# Altium schematic sheet rtm-damp-dvb-ADC-circuit.SchDoc
size A4
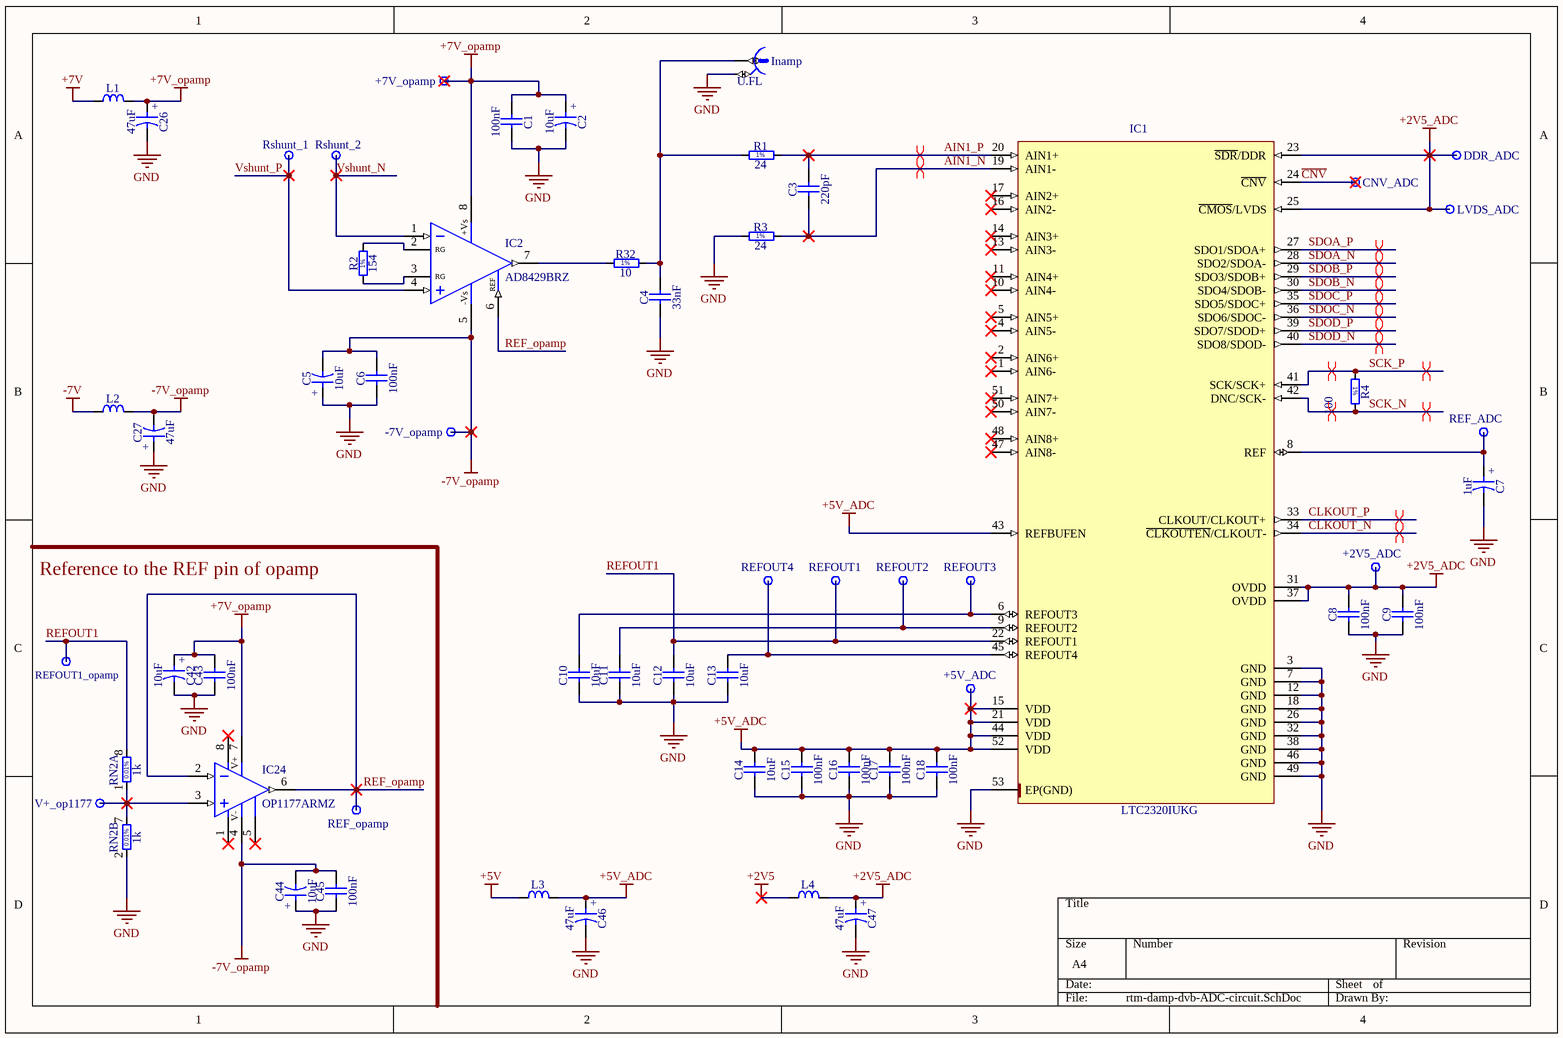
[diagram p0: rtm-damp-dvb-ADC-circuit.SchDoc]

## Parts
+2V5_ADC  Test Point  [TPS127]  (value not drawn)
+5V_ADC  Test Point  [TPS127]  (value not drawn)
+7V_opamp  Test Point  [TPS127]  (value not drawn)
-7V_opamp  Test Point  [TPS127]  (value not drawn)
C1  100nF  [CAPC2012X135N]
C2  10uF  [CAPAE530X540N]
C3  220pF  [CAPC1608X87N]
C4  33nF  [CAPC1608X87N]
C5  10uF  [CAPAE530X540N]
C6  100nF  [CAPC2012X135N]
C7  1uF  [CAPMP3216X180N]
C8  100nF  [CAPC2012X135N]
C9  100nF  [CAPC2012X135N]
C10  10uF  [CAPC2012X95N]
C11  10uF  [CAPC2012X95N]
C12  10uF  [CAPC2012X95N]
C13  10uF  [CAPC2012X95N]
C14  10uF  [CAPC2012X95N]
C15  100nF  [CAPC2012X135N]
C16  100nF  [CAPC2012X135N]
C17  100nF  [CAPC2012X135N]
C18  100nF  [CAPC2012X135N]
C26  47uF  [CAPMP3528X210N]
C27  47uF  [CAPMP3528X210N]
C42  10uF  [CAPAE530X540N]
C43  100nF  [CAPC2012X135N]
C44  10uF  [CAPAE530X540N]
C45  100nF  [CAPC2012X135N]
C46  47uF  [CAPMP3528X210N]
C47  47uF  [CAPMP3528X210N]
CNV_ADC  Test Point  [TPS127]  (value not drawn)
DDR_ADC  Test Point  [TPS127]  (value not drawn)
IC1  LTC2320IUKG  [QFN50P700X800X80-53N-R655X550]
IC2  AD8429BRZ  [SOIC127P600X175-8N]
IC24  OP1177ARMZ  [SOP65P490X110-8N]
Inamp  U.FL  [HIROSE_U.FL-R-SMT-1(10)]
L1  1K@100MHz  [INDC1608X95N]  (value not drawn)
L2  1K@100MHz  [INDC1608X95N]  (value not drawn)
L3  1K@100MHz  [INDC1608X95N]  (value not drawn)
L4  1K@100MHz  [INDC1608X95N]  (value not drawn)
LVDS_ADC  Test Point  [TPS127]  (value not drawn)
R1  24  [RESC1608X55N]
R2  154  [RESC1608X55N]
R3  24  [RESC1608X55N]
R4  100  [RESC1608X55N]
R32  10  [RESC1608X55N]
REF_ADC  Test Point  [TPS127]  (value not drawn)
REF_opamp  Test Point  [TPS127]  (value not drawn)
REFOUT1  Test Point  [TPS127]  (value not drawn)
REFOUT1_opamp  Test Point  [TPS127]  (value not drawn)
REFOUT2  Test Point  [TPS127]  (value not drawn)
REFOUT3  Test Point  [TPS127]  (value not drawn)
REFOUT4  Test Point  [TPS127]  (value not drawn)
RN2  1k  [SOIC127P600X175-8N]  (parts A,B of 4)
Rshunt_1  Test Point  [TPS127]  (value not drawn)
Rshunt_2  Test Point  [TPS127]  (value not drawn)
V+_op1177  Test Point  [TPS127]  (value not drawn)

## Nets
+2V5: L4.1
+2V5_ADC: +2V5_ADC.1 C8.2 C9.2 C47.1 DDR_ADC.1 IC1.23(~{SDR}/DDR) IC1.25(~{CMOS}/LVDS) IC1.31(OVDD) IC1.37(OVDD) L4.2 LVDS_ADC.1
+5V: L3.1
+5V_ADC: +5V_ADC.1 C14.2 C15.2 C16.2 C17.2 C18.2 C46.1 IC1.15(VDD) IC1.21(VDD) IC1.43(REFBUFEN) IC1.44(VDD) IC1.52(VDD) L3.2
+7V: L1.1
+7V_opamp: +7V_opamp.1 C1.1 C2.1 C26.1 C42.1 C43.2 IC2.8(+Vs) IC24.7(V+) L1.2
-7V: L2.1
-7V_opamp: -7V_opamp.1 C5.2 C6.2 C27.2 C44.2 C45.2 IC2.5(-Vs) IC24.4(V-) L2.2
GND: C1.2 C2.2 C4.1 C5.1 C6.1 C7.2 C8.1 C9.1 C10.1 C11.1 C12.1 C13.1 C14.1 C15.1 C16.1 C17.1 C18.1 C26.2 C27.1 C42.2 C43.1 C44.1 C45.1 C46.2 C47.2 IC1.3(GND) IC1.7(GND) IC1.12(GND) IC1.18(GND) IC1.26(GND) IC1.32(GND) IC1.38(GND) IC1.46(GND) IC1.49(GND) IC1.53(EP(GND)) Inamp.2 R3.1 RN2.2
AIN1_N: C3.1 IC1.19(AIN1-) R3.2
AIN1_P: C3.2 IC1.20(AIN1+) R1.2
~{CNV}: CNV_ADC.1 IC1.24(~{CNV})
CLKOUT_N: IC1.34(~{CLKOUTEN}/CLKOUT-)
CLKOUT_P: IC1.33(CLKOUT/CLKOUT+)
REF_opamp: IC2.6(REF) IC24.2(IN-) IC24.6(OUT) REF_opamp.1
REFOUT1: C12.2 IC1.22(REFOUT1) REFOUT1.1 REFOUT1_opamp.1 RN2.8
SCK_N: IC1.42(DNC/SCK-) R4.2
SCK_P: IC1.41(SCK/SCK+) R4.1
SDOA_N: IC1.28(SDO2/SDOA-)
SDOA_P: IC1.27(SDO1/SDOA+)
SDOB_N: IC1.30(SDO4/SDOB-)
SDOB_P: IC1.29(SDO3/SDOB+)
SDOC_N: IC1.36(SDO6/SDOC-)
SDOC_P: IC1.35(SDO5/SDOC+)
SDOD_N: IC1.40(SDO8/SDOD-)
SDOD_P: IC1.39(SDO7/SDOD+)
Vshunt_N: IC2.1(-IN) Rshunt_2.1
Vshunt_P: IC2.4(+IN) Rshunt_1.1
NetC4_2: C4.2 Inamp.1 R1.1 R32.2
NetC7_1: C7.1 IC1.8(REF) REF_ADC.1
NetC10_2: C10.2 IC1.6(REFOUT3) REFOUT3.1
NetC11_2: C11.2 IC1.9(REFOUT2) REFOUT2.1
NetC13_2: C13.2 IC1.45(REFOUT4) REFOUT4.1
NetIC2_2: IC2.2(RG) R2.2
NetIC2_3: IC2.3(RG) R2.1
NetIC2_7: IC2.7(Vout) R32.1
NetIC24_3: IC24.3(IN+) RN2.1 RN2.7 V+_op1177.1

Not connected (* = marked no-connect by the designer): IC1 1(AIN6-)* 2(AIN6+)* 4(AIN5-)* 5(AIN5+)* 10(AIN4-)* 11(AIN4+)* 13(AIN3-)* 14(AIN3+)* 16(AIN2-)* 17(AIN2+)* 47(AIN8-)* 48(AIN8+)* 50(AIN7-)* 51(AIN7+)*; IC24 1(NC)* 5(NC)* 8(NC)*

## Layout directives
differential pair: AIN1_N, AIN1_P, CLKOUT_N, CLKOUT_P, SCK_N, SCK_P, SDOA_N, SDOA_P, SDOB_N, SDOB_P, SDOC_N, SDOC_P, SDOD_N, SDOD_P

## Notes on the sheet
- Reference to the REF pin of opamp
- (in symbol CAE530-540_10UF_35V_20%) +
- (in symbol CTE3216-18_1UF_35V_10%_LESR3000) +
- (in symbol CTE3528-21_47UF_6.3V_10%_LESR0250) +
- (in symbol R0603_10R_1%_0.1W_200PPM) 1%
- (in symbol R0603_24R_1%_0.1W_100PPM) 1%
- (in symbol R0603_100R_1%_0.1W_100PPM) 1%
- (in symbol R0603_154R_1%_0.063W_10PPM) 1%

## Library data of the parts
+2V5_ADC +5V_ADC +7V_opamp -7V_opamp CNV_ADC DDR_ADC LVDS_ADC REF_ADC REF_opamp REFOUT1 REFOUT1_opamp REFOUT2-REFOUT4 Rshunt_1 Rshunt_2 V+_op1177 = SMD_PAD_1.27X1.27MM: Part Description: 1.27mm x 1.27mm PCB Copper Area (SMD Test Point); Mounted: No; Part Number: SMD_PAD_1.27X1.27MM; Component Kind: Standard (No BOM); Component Type: Standard (No BOM); Pin Count: 1; Family: Test Point; Socket: No; SMD: Yes; Sense: No; Status: None; ComponentHeight: 0mm; HelpURL: Undefined; Author: CERN DEM JLC; CreateDate: 12/01/2008; LatestRevisionDate: 12/01/2008; PackageDescription: 1.27mm x 1.27mm PCB Copper Area (SMD Test Point)
C1 C6 C8 C9 C15-C18 C43 C45 = CC0805_100NF_50V_10%_X7R: Non-polarised capacitor; Part Description: SMD Multilayer Chip Ceramic Capacitor; Manufacturer: GENERIC; Manufacturer1 Part Number: C2012X7R1H104K085AA; Voltage: 50V; TC: X7R; Tolerance: ±10%; Part Number: CC0805_100NF_50V_10%_X7R; Component Kind: Standard; Component Type: Standard; Pin Count: 2; Value: 100nF; Status: Preferred; Manufacturer Part Number: CC0805_100NF_50V_10%_X7R; Case: 0805; Mounted: Yes; Socket: No; SMD: Yes; Sense: No; Manufacturer1 Example: TDK; Manufacturer1 ComponentHeight: 1mm; HelpURL: \\cern.ch\dfs\Applications\Altium\Datasheets\CC0805_X7R_TDK_C.pdf; Author: CERN DEM JLC; CreateDate: 03/12/2007; LatestRevisionDate: 22/04/2015
C2 C5 C42 C44 = CAE530-540_10UF_35V_20%: Polarised capacitor; Part Description: Aluminum Electrolytic SMT Capacitor; Manufacturer: PANASONIC; Manufacturer Part Number: EEEFK1V100AR; Voltage: 35V; Tolerance: ±20%; Part Number: CAE530-540_10UF_35V_20%; Component Kind: Standard; Component Type: Standard; Pin Count: 2; Value: 10uF; Status: Not Recommended; Case: C; Mounted: Yes; Socket: No; SMD: Yes; Sense: No; ComponentHeight: 5.8mm; HelpURL: \\cern.ch\dfs\Applications\Altium\Datasheets\CAE_PANASONIC_FK.pdf; Author: CERN DEM JLC; CreateDate: 03/12/2007; LatestRevisionDate: 05/11/2014
C3 = CC0603_220PF_50V_5%_NP0: Non-polarised capacitor; Part Description: SMD Multilayer Chip Ceramic Capacitor; Manufacturer: GENERIC; Manufacturer1 Part Number: 223886715221; Voltage: 50V; TC: C0G/NP0; Tolerance: ±5%; Part Number: CC0603_220PF_50V_5%_NP0; Component Kind: Standard; Component Type: Standard; Pin Count: 2; Value: 220pF; Status: Preferred; Manufacturer Part Number: CC0603_220PF_50V_5%_NP0; Case: 0603; Mounted: Yes; Socket: No; SMD: Yes; Sense: No; Manufacturer1 Example: PHYCOMP; Manufacturer1 ComponentHeight: 0.87mm; HelpURL: \\cern.ch\dfs\Applications\Altium\Datasheets\CC0603_NP0_PHYCOMP.pdf; Author: CERN DEM JLC; CreateDate: 03/12/2007; LatestRevisionDate: 03/12/2007
C4 = CC0603_33NF_25V_10%_X7R: Non-polarised capacitor; Part Description: SMD Multilayer Chip Ceramic Capacitor; Manufacturer: GENERIC; Manufacturer1 Part Number: 223891615643; Voltage: 25V; TC: X7R; Tolerance: ±10%; Part Number: CC0603_33NF_25V_10%_X7R; Component Kind: Standard; Component Type: Standard; Pin Count: 2; Value: 33nF; Status: Preferred; Manufacturer Part Number: CC0603_33NF_25V_10%_X7R; Case: 0603; Mounted: Yes; Socket: No; SMD: Yes; Sense: No; Manufacturer1 Example: PHYCOMP; Manufacturer1 ComponentHeight: 0.87mm; HelpURL: \\cern.ch\dfs\Applications\Altium\Datasheets\CC0603_X7R_PHYCOMP.pdf; Author: CERN DEM JLC; CreateDate: 03/12/2007; LatestRevisionDate: 03/12/2007
C7 = CTE3216-18_1UF_35V_10%_LESR3000: Polarised capacitor; Part Description: Low ESR 3R0 Solid Tantalum Chip Capacitor; Manufacturer: GENERIC; Manufacturer1 Part Number: TPSA105K035R3000; Voltage: 35V; Tolerance: ±10%; Part Number: CTE3216-18_1UF_35V_10%_LESR3000; Component Kind: Standard; Component Type: Standard; Pin Count: 2; Value: 1uF; Status: Preferred; Manufacturer Part Number: CTE3216-18_1UF_35V_10%_LESR3000; Case: A; Mounted: Yes; Socket: No; SMD: Yes; Sense: No; Manufacturer1 Example: AVX; Manufacturer1 ComponentHeight: 1.8mm; HelpURL: \\cern.ch\dfs\Applications\Altium\Datasheets\CTE-LESR_AVX_TPS.pdf; Author: CERN DEM JLC; CreateDate: 05/05/2008; LatestRevisionDate: 20/01/2009
C10-C14 = CC0805_10UF_25V_10%_X5R: Non-polarised capacitor; Part Description: SMD Multilayer Chip Ceramic Capacitor; Manufacturer: GENERIC; Manufacturer1 Part Number: GRM219R61E106KA12D; Voltage: 25V; TC: X5R; Tolerance: ±10%; Part Number: CC0805_10UF_25V_10%_X5R; Component Kind: Standard; Component Type: Standard; Pin Count: 2; Value: 10uF; Status: Preferred; Manufacturer Part Number: CC0805_10UF_25V_10%_X5R; Case: 0805; Mounted: Yes; Socket: No; SMD: Yes; Sense: No; Manufacturer1 Example: MURATA; Manufacturer1 ComponentHeight: 0.95mm; HelpURL: \\cern.ch\dfs\Applications\Altium\Datasheets\CC0805_X5R_MURATA_GRM.pdf; Author: CERN DEM JLC; CreateDate: 25/10/2012; LatestRevisionDate: 06/09/2016
C26 C27 C46 C47 = CTE3528-21_47UF_6.3V_10%_LESR0250: Polarised capacitor; Part Description: Low ESR 0R25 Solid Tantalum Chip Capacitor; Manufacturer: GENERIC; Manufacturer1 Part Number: TPSB476K006R0250; Voltage: 6.3V; Tolerance: ±10%; Part Number: CTE3528-21_47UF_6.3V_10%_LESR0250; Component Kind: Standard; Component Type: Standard; Pin Count: 2; Value: 47uF; Status: Preferred; Manufacturer Part Number: CTE3528-21_47UF_6.3V_10%_LESR0250; Case: B; Mounted: Yes; Socket: No; SMD: Yes; Sense: No; Manufacturer1 Example: AVX; Manufacturer1 ComponentHeight: 2.1mm; HelpURL: \\cern.ch\dfs\Applications\Altium\Datasheets\CTE-LESR_AVX_TPS.pdf; Author: CERN DEM JLC; CreateDate: 05/05/2008; LatestRevisionDate: 20/01/2009
IC1 = LTC2320IUKG: Octal, 16-Bit, 1.5Msps/Ch  Simultaneous Sampling ADC; Manufacturer: LINEAR TECHNOLOGY; PressFit: No; Bonding: No; Part Number: LTC2320IUKG; Component Kind: Standard; Component Type: Standard; Device: LTC2320IUKG; PackageDescription: QFP, 0.50mm pitch, square; 12 pin X 14 pin, 7.00mm X 8.00mm, IPC Medium Density; Part Description: Octal, 16-Bit, 1.5Msps/Ch Simultaneous Sampling ADC; Manufacturer Part Number: LTC2320IUKG; Pin Count: 53; Case: QFN52; Mounted: Yes; Socket: No; SMD: Yes; Sense: No; ComponentHeight: 0.8mm; Author: LNLS DIG LOS; CreateDate: 21/02/2018; LatestRevisionDate: 08/03/2018
IC2 = AD8429BRZ: 1 nV/sqrt Hz Low Noise Instrumentation Amplifier; Manufacturer: ANALOG DEVICES; PressFit: No; Bonding: No; Part Number: AD8429BRZ; Component Kind: Standard; Component Type: Standard; Device: AD8429BRZ; PackageDescription: SOIC 8, Pitch 1.27mm - Body 4x5mm, IPC Medium Density; Part Description: 1nV/sqrt Hz Low Noise Instrumentation Amplifier; Manufacturer Part Number: AD8429BRZ; Pin Count: 8; Case: SOIC8; Mounted: Yes; Socket: No; SMD: Yes; Sense: No; ComponentHeight: 1.75mm; Author: CERN DEM JLC; HelpURL: \\cern.ch\dfs\Applications\Altium\Datasheets\AD8429BRZ.pdf; CreateDate: 31/08/2011; LatestRevisionDate: 31/08/2011
IC24 = OP1177ARMZ: Operational Amplifier; Part Description: Precision Low Noise, Low Input Bias Current Operational Amplifiers; Manufacturer: ANALOG DEVICES; PressFit: No; Bonding: No; Part Number: OP1177ARMZ; Component Kind: Standard; Component Type: Standard; Device: OP1177ARMZ; PackageDescription: SOP, 0.65mm pitch; 8 pin, 3.00mm W X 3.00mm L X 1.10mm H body, IPC Medium Density; Manufacturer Part Number: OP1177ARMZ; Pin Count: 8; Case: MSOP8; Mounted: Yes; Socket: No; SMD: Yes; Sense: No; ComponentHeight: 1.1mm; Author: LNLS DIG LOS; CreateDate: 21/06/2018; LatestRevisionDate: 21/06/2018
Inamp = HIROSE_U.FL-R-SMT-1(10): Part Description: Up to 6GHz Ultra Small Surface Mount Male Coaxial Connectors U.FL Series; Manufacturer: HIROSE (HRS); PressFit: No; Part Number: HIROSE_U.FL-R-SMT-1(10); Component Kind: Standard; Component Type: Standard; Pin Count: 2; Family: U.FL; Mounted: Yes; Socket: No; SMD: Yes; Sense: No; Status: None; Manufacturer Part Number: U.FL-R-SMT-1(10); ComponentHeight: 1.25mm; HelpURL: \\cern.ch\dfs\Applications\Altium\Datasheets\HIROSE_U.FL-R-SMT-1(10).pdf; Author: CERN DEM JLC; CreateDate: 24/03/2010; LatestRevisionDate: 24/03/2010
L1-L4 = IND0603_MURATA_BLM18AG102SN1D: Inductor; Part Description: SMD EMIFIL Suppression Chip Ferrite Bead; Manufacturer: MURATA; Power: 400mA; Resistance: 0.50R; Tolerance: ±25%; Part Number: IND0603_MURATA_BLM18AG102SN1D; Component Kind: Standard; Component Type: Standard; Pin Count: 2; Value: 1K@100MHz; Status: None; Manufacturer Part Number: BLM18AG102SN1D; Case: 0603; Mounted: Yes; Socket: No; SMD: Yes; Sense: No; ComponentHeight: 0.95mm; Author: LNLS DIG GBMB; CreateDate: 03/11/2017; LatestRevisionDate: 03/11/2017
R1 R3 = R0603_24R_1%_0.1W_100PPM: Resistor - 1%; Part Description: General Purpose Thick Film Chip Resistor; Manufacturer: GENERIC; Manufacturer1 Part Number: NRC06F24R0TRF; Power: 0.1W; TC: ±100ppm/°C; Part Number: R0603_24R_1%_0.1W_100PPM; Component Kind: Standard; Component Type: Standard; Pin Count: 2; Value: 24; Status: Preferred; Tolerance: ±1%; Manufacturer Part Number: R0603_24R_1%_0.1W_100PPM; Case: 0603; Mounted: Yes; Sense: No; Socket: No; SMD: Yes; Manufacturer1 Example: NIC COMPONENT; Manufacturer1 ComponentHeight: 0.55mm; HelpURL: \\cern.ch\dfs\Applications\Altium\Datasheets\R0603_NIC_NRC.pdf; Author: CERN DEM JLC; CreateDate: 03/12/2007; LatestRevisionDate: 13/03/2008
R2 = R0603_154R_1%_0.063W_10PPM: Resistor - 1%; Part Description: General Purpose Thick Film Chip Resistor; Manufacturer: GENERIC; Manufacturer Part Number: R0603_154R_1%_0.1W_100PPM; Manufacturer1 Part Number: RC0603FR-07154RL; Power: 0.1W; TC: ±100ppm; Part Number: R0603_154R_1%_0.063W_10PPM; Component Kind: Standard; Component Type: Standard; Pin Count: 2; Value: 154; Tolerance: ±1%; Case: 0603; Mounted: Yes; Sense: No; Socket: No; SMD: Yes; Manufacturer1 Example: YAGEO PHYCOMP; Manufacturer1 ComponentHeight: 0.6mm; Author: LNLS DIG GBMB; CreateDate: 05/11/2018; LatestRevisionDate: 05/11/2018
R4 = R0603_100R_1%_0.1W_100PPM: Resistor - 1%; Part Description: General Purpose Thick Film Chip Resistor; Manufacturer: GENERIC; Manufacturer1 Part Number: NRC06F1000TRF; Power: 0.1W; TC: ±100ppm/°C; Part Number: R0603_100R_1%_0.1W_100PPM; Component Kind: Standard; Component Type: Standard; Pin Count: 2; Value: 100; Status: Preferred; Tolerance: ±1%; Manufacturer Part Number: R0603_100R_1%_0.1W_100PPM; Case: 0603; Mounted: Yes; Sense: No; Socket: No; SMD: Yes; Manufacturer1 Example: NIC COMPONENT; Manufacturer1 ComponentHeight: 0.55mm; HelpURL: \\cern.ch\dfs\Applications\Altium\Datasheets\R0603_NIC_NRC.pdf; Author: CERN DEM JLC; CreateDate: 03/12/2007; LatestRevisionDate: 13/03/2008
R32 = R0603_10R_1%_0.1W_200PPM: Resistor - 1%; Part Description: General Purpose Thick Film Chip Resistor; Manufacturer: GENERIC; Manufacturer1 Part Number: NRC06F10R0TRF; Power: 0.1W; TC: ±200ppm/°C; Part Number: R0603_10R_1%_0.1W_200PPM; Component Kind: Standard; Component Type: Standard; Pin Count: 2; Value: 10; Status: Preferred; Tolerance: ±1%; Manufacturer Part Number: R0603_10R_1%_0.1W_200PPM; Case: 0603; Mounted: Yes; Sense: No; Socket: No; SMD: Yes; Manufacturer1 Example: NIC COMPONENT; Manufacturer1 ComponentHeight: 0.55mm; HelpURL: \\cern.ch\dfs\Applications\Altium\Datasheets\R0603_NIC_NRC.pdf; Author: CERN DEM JLC; CreateDate: 03/12/2007; LatestRevisionDate: 24/06/2009
RN2 = RN_1K_1K_VISHAY_Y1365V0191QT9R: DIL8 Resistor Network 4 Isolated Resistor 0.01%; Part Description: Bulk Metal® Foil Thecnology High Precision 4 Resistors Network - SMN Series; Manufacturer: VISHAY FOIL RESISTOR; Power: 4x0.1W; TC: ±2ppm/°C; Part Number: RN_1K_1K_VISHAY_Y1365V0191QT9R; Component Kind: Standard; Component Type: Standard; Pin Count: 8; Value: 1k; Sense: No; Tolerance: 0.01%; Manufacturer Part Number: Y1365V0191QT9R; Case: SOIC8; Mounted: Yes; Socket: No; SMD: Yes; ComponentHeight: 1.73mm; HelpURL: \\cern.ch\dfs\Applications\Altium\Datasheets\RN_VISHAY_SMN.pdf; Author: CERN DEM JLC; CreateDate: 19/05/2014; LatestRevisionDate: 19/05/2014